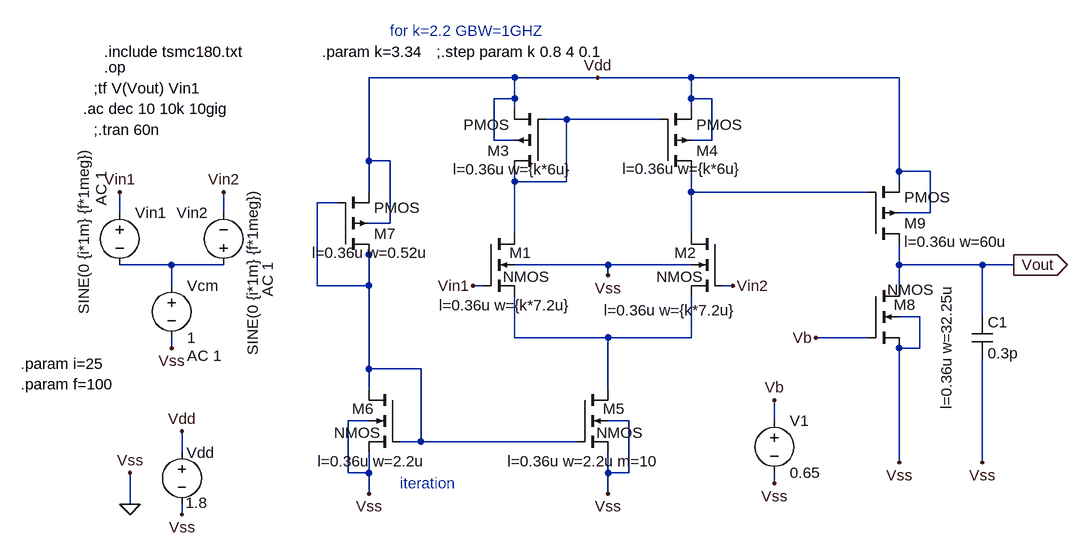
[diagram p0: schematic Two stage OP_AMP_1.asc]
Two stage OP_AMP_1.asc, the LTspice schematic file:
Version 4
SHEET 1 1856 740
WIRE 976 -16 752 -16
WIRE 1104 -16 976 -16
WIRE 1248 -16 1104 -16
WIRE 1568 -16 1248 -16
WIRE 976 16 976 -16
WIRE 976 16 944 16
WIRE 1248 16 1248 -16
WIRE 1280 16 1248 16
WIRE 976 32 976 16
WIRE 1248 32 1248 16
WIRE 1056 48 1024 48
WIRE 1200 48 1056 48
WIRE 944 80 944 16
WIRE 976 80 944 80
WIRE 1280 80 1280 16
WIRE 1280 80 1248 80
WIRE 752 112 752 -16
WIRE 784 112 752 112
WIRE 1568 128 1568 -16
WIRE 1616 128 1568 128
WIRE 976 144 976 128
WIRE 1056 144 1056 48
WIRE 1056 144 976 144
WIRE 1568 144 1568 128
WIRE 752 160 752 112
WIRE 1248 160 1248 128
WIRE 1520 160 1248 160
WIRE 704 176 672 176
WIRE 368 192 368 160
WIRE 528 192 528 160
WIRE 1616 192 1616 128
WIRE 1616 192 1568 192
WIRE 784 208 784 112
WIRE 784 208 752 208
WIRE 976 224 976 144
WIRE 1248 224 1248 160
WIRE 752 256 752 240
WIRE 448 272 368 272
WIRE 528 272 448 272
WIRE 1120 272 976 272
WIRE 1248 272 1120 272
WIRE 1568 272 1568 240
WIRE 1696 272 1568 272
WIRE 1744 272 1696 272
WIRE 1120 288 1120 272
WIRE 448 304 448 272
WIRE 672 304 672 176
WIRE 752 304 752 256
WIRE 752 304 672 304
WIRE 928 304 912 304
WIRE 1312 304 1296 304
WIRE 1568 304 1568 272
WIRE 1600 352 1568 352
WIRE 1696 352 1696 272
WIRE 976 384 976 320
WIRE 1120 384 976 384
WIRE 1248 384 1248 320
WIRE 1248 384 1120 384
WIRE 1520 384 1440 384
WIRE 448 400 448 384
WIRE 1600 400 1600 352
WIRE 1600 400 1568 400
WIRE 752 432 752 304
WIRE 832 432 752 432
WIRE 752 464 752 432
WIRE 1120 464 1120 384
WIRE 752 512 720 512
WIRE 1152 512 1120 512
WIRE 1376 512 1376 480
WIRE 832 544 832 432
WIRE 832 544 800 544
WIRE 1072 544 832 544
WIRE 464 560 464 528
WIRE 1568 576 1568 400
WIRE 1696 576 1696 416
WIRE 720 592 720 512
WIRE 752 592 752 560
WIRE 752 592 720 592
WIRE 1120 592 1120 560
WIRE 1152 592 1152 512
WIRE 1152 592 1120 592
WIRE 1376 608 1376 592
WIRE 752 624 752 592
WIRE 1120 624 1120 592
WIRE 384 640 384 592
WIRE 464 656 464 640
FLAG 384 640 0
FLAG 384 592 Vss
FLAG 464 656 Vss
FLAG 448 400 Vss
FLAG 464 528 Vdd
FLAG 912 304 Vin1
FLAG 1104 -16 Vdd
FLAG 1312 304 Vin2
FLAG 1120 288 Vss
FLAG 368 160 Vin1
FLAG 528 160 Vin2
FLAG 1120 624 Vss
FLAG 752 624 Vss
FLAG 1568 576 Vss
FLAG 1744 272 Vout
IOPIN 1744 272 Out
FLAG 1696 576 Vss
FLAG 1440 384 Vb
FLAG 1376 608 Vss
FLAG 1376 480 Vb
SYMBOL nmos4 928 224 R0
WINDOW 0 40 29 Left 2
WINDOW 3 30 66 Left 2
WINDOW 123 135 110 Right 2
SYMATTR InstName M1
SYMATTR Value2 l=0.36u w={k*7.2u}
SYMBOL voltage 464 544 R0
WINDOW 123 0 0 Left 0
WINDOW 39 0 0 Left 0
WINDOW 0 7 17 Left 2
WINDOW 3 6 94 Left 2
SYMATTR InstName Vdd
SYMATTR Value 1.8
SYMBOL nmos4 1296 224 M0
WINDOW 0 40 29 Left 2
WINDOW 3 30 66 Left 2
WINDOW 123 -21 118 Left 2
SYMATTR InstName M2
SYMATTR Value2 l=0.36u w={k*7.2u}
SYMBOL voltage 448 288 R0
WINDOW 123 24 124 Left 2
WINDOW 39 0 0 Left 0
SYMATTR Value2 AC 1
SYMATTR InstName Vcm
SYMATTR Value 1
SYMBOL voltage 368 176 R0
WINDOW 3 -55 -84 VRight 2
WINDOW 123 -28 -48 VRight 2
WINDOW 39 0 0 Left 0
SYMATTR Value SINE(0 {i*1m} {f*1meg})
SYMATTR Value2 AC 1
SYMATTR InstName Vin1
SYMBOL voltage 528 288 R180
WINDOW 0 24 96 Left 2
WINDOW 3 -45 -123 VRight 2
WINDOW 123 -68 -33 VRight 2
WINDOW 39 0 0 Left 0
SYMATTR InstName Vin2
SYMATTR Value SINE(0 {i*1m} {f*1meg})
SYMATTR Value2 AC 1
SYMBOL pmos4 1024 128 R180
WINDOW 123 -40 3 Left 2
SYMATTR Value2 l=0.36u w={k*6u}
SYMATTR InstName M3
SYMBOL pmos4 1200 128 M180
WINDOW 123 -58 4 Left 2
SYMATTR Value2 l=0.36u w={k*6u}
SYMATTR InstName M4
SYMBOL nmos4 1072 464 R0
WINDOW 0 40 29 Left 2
WINDOW 3 30 66 Left 2
WINDOW 123 127 110 Right 2
SYMATTR InstName M5
SYMATTR Value2 l=0.36u w=2.2u m=10
SYMBOL nmos4 800 464 M0
WINDOW 0 40 29 Left 2
WINDOW 3 30 66 Left 2
WINDOW 123 127 110 Right 2
SYMATTR InstName M6
SYMATTR Value2 l=0.36u w=2.2u
SYMBOL pmos4 704 256 M180
WINDOW 123 -40 3 Left 2
SYMATTR Value2 l=0.36u w=0.52u
SYMATTR InstName M7
SYMBOL nmos4 1520 304 R0
WINDOW 0 40 29 Left 2
WINDOW 3 30 6 Left 2
WINDOW 123 121 -2 VRight 2
SYMATTR InstName M8
SYMATTR Value2 l=0.36u w=32.25u
SYMBOL cap 1680 352 R0
SYMATTR InstName C1
SYMATTR Value 0.3p
SYMBOL pmos4 1520 240 M180
WINDOW 123 56 4 Left 2
SYMATTR Value2 l=0.36u w=60u
SYMATTR InstName M9
SYMBOL voltage 1376 496 R0
WINDOW 123 0 0 Left 0
WINDOW 39 0 0 Left 0
SYMATTR InstName V1
SYMATTR Value 0.65
TEXT 344 -56 Left 2 !.include tsmc180.txt
TEXT 344 -32 Left 2 !.op
TEXT 328 0 Left 2 !;tf V(Vout) Vin1
TEXT 312 32 Left 2 !.ac dec 10 10k 10gig
TEXT 328 64 Left 2 !;.tran 60n
TEXT 680 -56 Left 2 !.param k=3.34
TEXT 856 -56 Left 2 !;.step param k 0.8 4 0.1
TEXT 784 -88 Left 2 ;for k=2.2 GBW=1GHZ
TEXT 800 608 Left 2 ;iteration
TEXT 216 424 Left 2 !.param i=25\n.param f=100

The netlist it stands for:
* Two stage OP_AMP_1.asc
M1 N001 Vin1 N005 0 NMOS l=0.36u w={k*7.2u}
Vdd Vdd 0 1.8
M2 N002 Vin2 N005 0 NMOS l=0.36u w={k*7.2u}
Vcm N004 0 1 AC 1
Vin1 Vin1 N004 SINE(0 {i*1m} {f*1meg}) AC 1
Vin2 N004 Vin2 SINE(0 {i*1m} {f*1meg}) AC 1
M3 N001 N001 Vdd Vdd PMOS l=0.36u w={k*6u}
M4 N002 N001 Vdd Vdd PMOS l=0.36u w={k*6u}
M5 N005 N003 0 0 NMOS l=0.36u w=2.2u m=10
M6 N003 N003 0 0 NMOS l=0.36u w=2.2u
M7 N003 N003 Vdd Vdd PMOS l=0.36u w=0.52u
M8 Vout Vb 0 0 NMOS l=0.36u w=32.25u
C1 Vout 0 0.3p
M9 Vout N002 Vdd Vdd PMOS l=0.36u w=60u
V1 Vb 0 0.65
.model NMOS NMOS
.model PMOS PMOS
.lib standard.mos
.include tsmc180.txt
.op
;tf V(Vout) Vin1
.ac dec 10 10k 10gig
;.tran 60n
.param k=3.34
;.step param k 0.8 4 0.1
* for k=2.2 GBW=1GHZ
* iteration
.param i=25
.param f=100
.backanno
.end